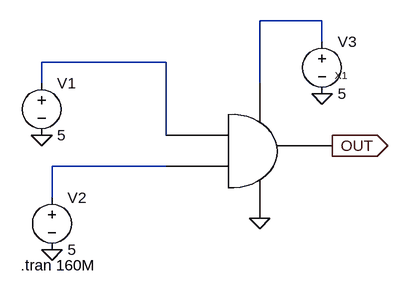
[diagram p0: schematic andgateimplytesting.asc]
andgateimplytesting.asc, the LTspice schematic file:
Version 4
SHEET 1 880 680
WIRE 304 -48 208 -48
WIRE 304 -16 304 -48
WIRE 64 16 -128 16
WIRE -128 48 -128 16
WIRE 208 48 208 -48
WIRE 64 128 64 16
WIRE 64 176 -112 176
WIRE -112 224 -112 176
FLAG -128 128 0
FLAG -112 304 0
FLAG 208 256 0
FLAG 304 64 0
FLAG 320 144 OUT
IOPIN 320 144 Out
SYMBOL andgateimply 96 144 R0
SYMATTR InstName X1
SYMBOL voltage -128 32 R0
WINDOW 123 0 0 Left 0
WINDOW 39 0 0 Left 0
SYMATTR InstName V1
SYMATTR Value 5
SYMBOL voltage -112 208 R0
WINDOW 123 0 0 Left 0
WINDOW 39 0 0 Left 0
SYMATTR InstName V2
SYMATTR Value 5
SYMBOL voltage 304 -32 R0
WINDOW 123 0 0 Left 0
WINDOW 39 0 0 Left 0
SYMATTR InstName V3
SYMATTR Value 5
TEXT -160 328 Left 2 !.tran 160M

The netlist it stands for:
* andgateimplytesting.asc
XX1 N001 0 N002 N003 OUT andgateimply  ; pins VDD VSS A B OUT
V1 N002 0 5
V2 N003 0 5
V3 N001 0 5
.tran 160M
.backanno
.end